# Altium project SmartOutletProject.PrjPcb
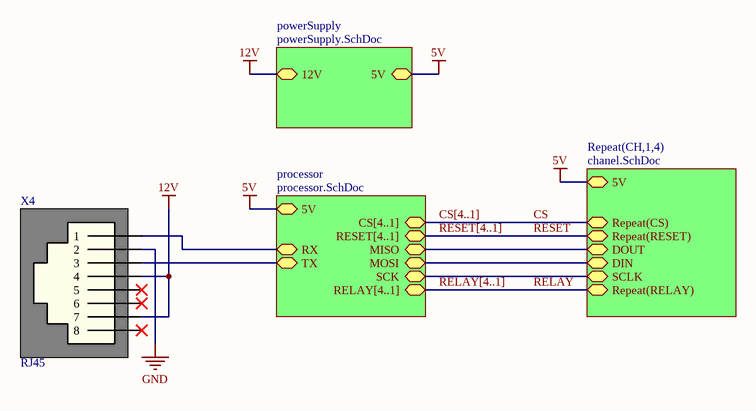
[diagram p0: main.SchDoc]
4 sheets, 214 parts. Net scope: hierarchical (ports join the sheet entries above them; power ports are global).
Board file: PCB.PcbDoc
Sheets:
  main.SchDoc
    CH1 = chanel.SchDoc
    CH2 = chanel.SchDoc
    CH3 = chanel.SchDoc
    CH4 = chanel.SchDoc
    processor = processor.SchDoc
    powerSupply = powerSupply.SchDoc

## Sheet main.SchDoc
size A

### Parts
X4  RJ45  [RJ45]

### Sub-sheets
powerSupply = powerSupply.SchDoc: 5V, 12V
processor = processor.SchDoc: MISO, RELAY[4..1], RESET[4..1], CS[4..1], MOSI, SCK, RX, TX, 5V
Repeat(CH,1,4) = chanel.SchDoc: Repeat(CS), Repeat(RESET), DOUT, DIN, SCLK, Repeat(RELAY), 5V

### Nets
5V: sheet Repeat(CH,1,4)/5V, sheet processor/5V, sheet powerSupply/5V
12V: X4.4 X4.7 ; sheet powerSupply/12V
GND: X4.2
CS: sheet Repeat(CH,1,4)/Repeat(CS)
MISO: sheet Repeat(CH,1,4)/DOUT, sheet processor/MISO
MOSI: sheet Repeat(CH,1,4)/DIN, sheet processor/MOSI
RELAY: sheet Repeat(CH,1,4)/Repeat(RELAY)
RESET: sheet Repeat(CH,1,4)/Repeat(RESET)
RX: X4.1 ; sheet processor/RX
SCK: sheet Repeat(CH,1,4)/SCLK, sheet processor/SCK
TX: X4.3 ; sheet processor/TX

Not connected (* = marked no-connect by the designer): X4 5* 6* 8*

### Buses and harness runs
bus CS[4..1] = sheet processor/CS[4..1]
bus RELAY[4..1] = sheet processor/RELAY[4..1]
bus RESET[4..1] = sheet processor/RESET[4..1]

### Library data of the parts
X4 = RJ45: Outlet YH-55-05 8P8C 5521; Link: https://www.rcscomponents.kiev.ua/product/rozetka-yh-55-05-8p8c-5521-l-kls12-133-8p8c-w-o-2-01_8324.html

## Sheet chanel.SchDoc
size A4
Used 4 times, as channels CH1, CH2, CH3, CH4. Parts and nets are listed once, with the designators drawn on the sheet.
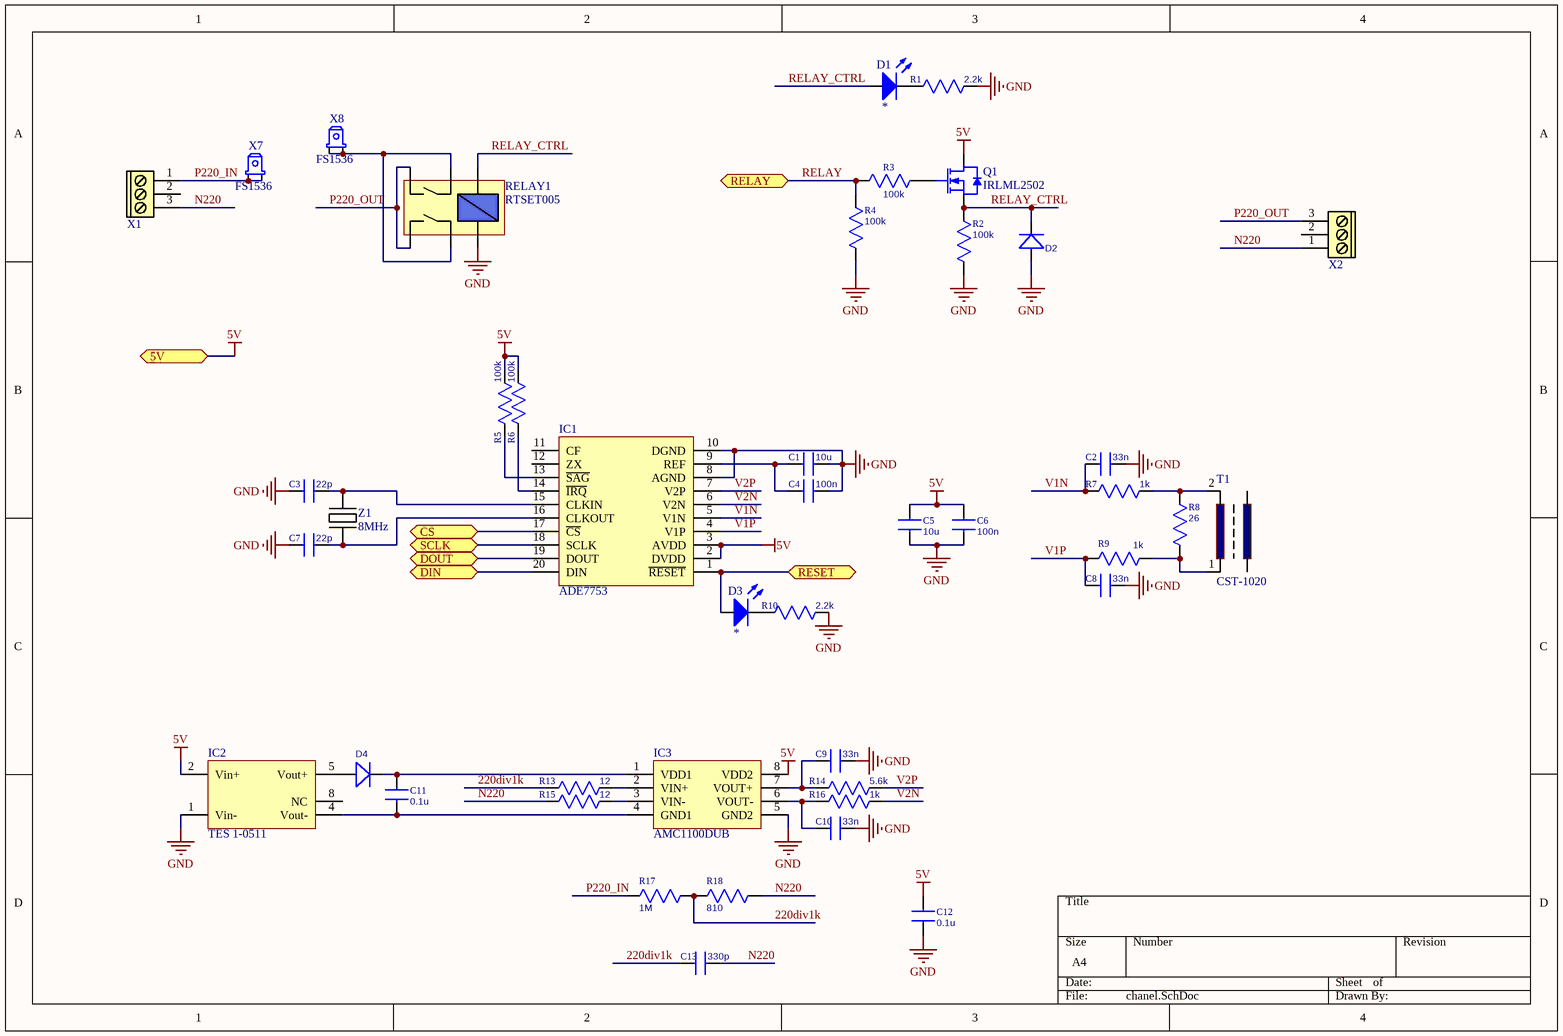
[diagram p1: chanel.SchDoc]

### Parts
C1  10u  [C_0805]
C2  33n  [C_0603]
C3  22p  [C_0603]
C4  100n  [C_0603]
C5  10u  [C_0805]
C6  100n  [C_0603]
C7  22p  [C_0603]
C8  33n  [C_0603]
C9  33n  [C_0603]
C10  33n  [C_0603]
C11  0.1u  [C_0603]
C12  0.1u  [C_0603]
C13  330p  [C_0603]
D1  *  [LED_5mm]
D2  D_DO-214AC  [DO-214AC]  (value not drawn)
D3  *  [LED_5mm]
D4  D_DO-214AC  [DO-214AC]  (value not drawn)
IC1  ADE7753  [SOP-20]
IC2  TES 1-0511  [TES 1-0511]
IC3  AMC1100DUB  [SOP254-8N]
Q1  IRLML2502  [SOT23]
R1  2.2k  [R_0603]
R2  100k  [R_0603]
R3  100k  [R_0603]
R4  100k  [R_0603]
R5  100k  [R_0603]
R6  100k  [R_0603]
R7  1k  [R_0603]
R8  26  [R_0805]
R9  1k  [R_0603]
R10  2.2k  [R_0603]
R13  12  [R_0603]
R14  5.6k  [R_0603]
R15  12  [R_0603]
R16  1k  [R_0603]
R17  1M  [R_0805]
R18  810  [R_0805]
RELAY1  RTSET005  [RTSET005]
T1  CST-1020  [CST-1020]
X1  DG-300-3  [DG-300-5MM-3]  (value not drawn)
X2  DG-300-3  [DG-300-5MM-3]  (value not drawn)
X7  FS1536  [FS1536]
X8  FS1536  [FS1536]
Z1  8MHz  [HC-49]

### Ports
5V, CS, DIN, DOUT, RELAY, RESET, SCLK

### Nets
5V: C5.2 C6.2 C12.2 IC1.2(DVDD) IC1.3(AVDD) IC2.2(Vin+) IC3.8(VDD2) Q1.3(D) R5.2 R6.2 ; port 5V
GND: C1.2 C2.2 C3.1 C4.2 C5.1 C6.1 C7.1 C8.2 C9.2 C10.2 C12.1 D2.1(A) IC1.8(AGND) IC1.10(DGND) IC2.1(Vin-) IC3.5(GND2) R1.2 R2.2 R4.2 R10.2 RELAY1.6
220div1k: C13.1 R13.1 R17.2 R18.1
CS: IC1.17(~{CS}) ; port CS
DIN: IC1.20(DIN) ; port DIN
DOUT: IC1.19(DOUT) ; port DOUT
N220: C13.2 R15.1 R18.2 X1.3 X2.1
P220_IN: R17.1 X1.1 X7.1
P220_OUT: RELAY1.1 RELAY1.2 X2.3
RELAY: R3.2 R4.1 ; port RELAY
RELAY_CTRL: D1.1(A) D2.2(K) Q1.2(S) R2.1 RELAY1.5
RESET: D3.1(A) IC1.1(~{RESET}) ; port RESET
SCLK: IC1.18(SCLK) ; port SCLK
V1N: C2.1 IC1.5(V1N) R7.1
V1P: C8.1 IC1.4(V1P) R9.1
V2N: IC1.6(V2N) R16.2
V2P: IC1.7(V2P) R14.2
NetC1_1: C1.1 C4.1 IC1.9(REF)
NetC3_2: C3.2 IC1.15(CLKIN) Z1.2
NetC7_2: C7.2 IC1.16(CLKOUT) Z1.1
NetC9_1: C9.1 IC3.7(VOUT+) R14.1
NetC10_1: C10.1 IC3.6(VOUT-) R16.1
NetC11_1: C11.1 IC2.4(Vout-) IC3.4(GND1)
NetC11_2: C11.2 D4.2(K) IC3.1(VDD1)
NetD1_2: D1.2(K) R1.1
NetD3_2: D3.2(K) R10.1
NetD4_1: D4.1(A) IC2.5(Vout+)
NetIC1_13: IC1.13(~{SAG}) R5.1
NetIC1_14: IC1.14(~{IRQ}) R6.1
NetIC3_2: IC3.2(VIN+) R13.2
NetIC3_3: IC3.3(VIN-) R15.2
NetQ1_1: Q1.1(G) R3.1
NetR7_2: R7.2 R8.1 T1.2
NetR8_2: R8.2 R9.2 T1.1
NetRELAY1_3: RELAY1.3 RELAY1.4 X8.1

Not connected (* = marked no-connect by the designer): IC1 11(CF) 12(ZX); IC2 8(NC); X1 2; X2 2

### Channels
CH1: designators end in _CH1; ports 5V=5V CS=CS1 DIN=MOSI DOUT=MISO RELAY=RELAY RESET=RESET1 SCLK=SCK
CH2: designators end in _CH2; ports 5V=5V CS=CS2 DIN=MOSI DOUT=MISO RELAY=RELAY RESET=RESET2 SCLK=SCK
CH3: designators end in _CH3; ports 5V=5V CS=CS3 DIN=MOSI DOUT=MISO RELAY=RELAY RESET=RESET3 SCLK=SCK
CH4: designators end in _CH4; ports 5V=5V CS=CS4 DIN=MOSI DOUT=MISO RELAY=RELAY RESET=RESET4 SCLK=SCK

### Library data of the parts
C1 C5 = C0805: Capacitor; Value: 10u
C2-C4 C6-C13 = C0603: Capacitor
  C2 C8-C10: Value: 33n
  C3 C7: Value: 22p
  C4 C6: Value: 100n
  C11 C12: Value: 0.1u
  C13: Value: 330p
D1 D3 = LED_5mm: Typical INFRARED GaAs LED; Value: *; Color: *
D2 D4 = D_DO-214AC: Diode
IC1 = ADE7753ARSZ: Data Acquisition ADC/DAC
IC2 = TES 1-0511: Isolated DC/DC Converter
IC3 = AMC1100DUB: Isolation Amplifier 4.25kV PEAK Iso Amp
Q1 = N-ch_SOT23: N-Channel Enhancement Mode MOSFET; Published: 17-Dec-2003; DatasheetVersion: May-99; PackageVersion: 1996; PackageReference: SOT23; Publisher: Altium Limited; PackageDescription: SOT-23; 3 Leads; Body 3.1 x 2.5 mm, inc. leads (LxW max), Alternate Lead Configuration; ComponentLink1Description: Manufacturer Link; ComponentLink1URL: http://www.zetex.com/; ComponentLink2Description: Datasheet; ComponentLink2URL: www.zetex.com/3.0/pdf/ZXM61N02F.pdf
R1-R7 R9 R10 R13-R16 = R0603: Resistor
  R1 R10: Value: 2.2k
  R2-R6: Value: 100k
  R7 R9 R16: Value: 1k
  R13 R15: Value: 12
  R14: Value: 5.6k
R8 R17 R18 = R0805: Resistor
  R8: Value: 26
  R17: Value: 1M
  R18: Value: 810
RELAY1 = 1-1415898-8: General Purpose Relay
T1 = CST-1020: Current Transformer
X7 X8 = FS1536: PCB Soldering tips
Z1 = XTAL: Quartz resonator

## Sheet processor.SchDoc
size A4
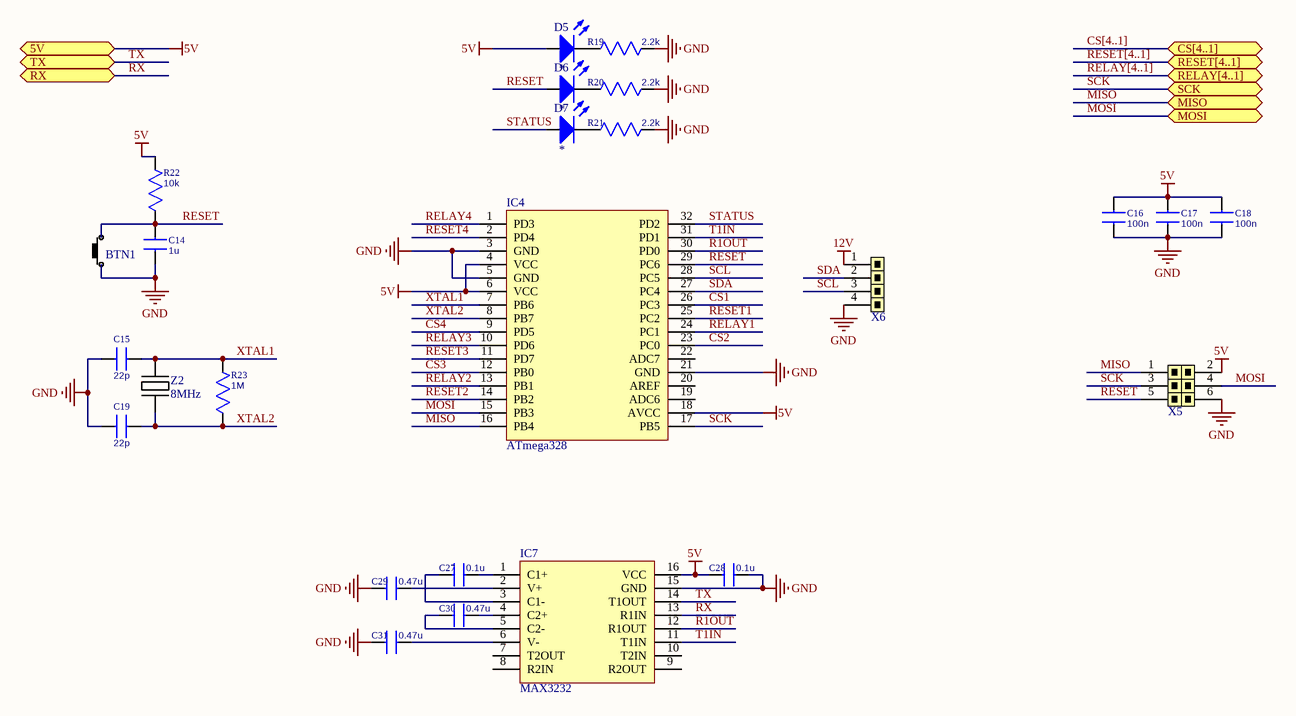
[diagram p2: processor.SchDoc]

### Parts
BTN1  Push Button  [PUSH BUTTON]  (value not drawn)
C14  1u  [C_0603]
C15  22p  [C_0603]
C16  100n  [C_0603]
C17  100n  [C_0603]
C18  100n  [C_0603]
C19  22p  [C_0603]
C27  0.1u  [C_0805]
C28  0.1u  [C_0805]
C29  0.47u  [C_0805]
C30  0.47u  [C_0805]
C31  0.47u  [C_0805]
D5  *  [LED_5mm]
D6  *  [LED_5mm]
D7  *  [LED_5mm]
IC4  ATmega328  [TQFP-32]
IC7  MAX3232  [SSOP-16]
R19  2.2k  [R_0603]
R20  2.2k  [R_0603]
R21  2.2k  [R_0603]
R22  10k  [R_0603]
R23  1M  [R_0603]
X5  PLD-6  [PLD-6]  (value not drawn)
X6  PLS-4  [PLS-4]  (value not drawn)
Z2  8MHz  [HC-49]

### Ports
5V, CS[4..1], MISO, MOSI, RELAY[4..1], RESET[4..1], RX, SCK, TX

### Nets
5V: C16.2 C17.2 C18.2 C28.1 D5.1(A) IC4.4(VCC) IC4.6(VCC) IC4.18(AVCC) IC7.16(VCC) R22.1 X5.2 ; port 5V
12V: X6.1
GND: BTN1.1 C14.1 C15.2 C16.1 C17.1 C18.1 C19.2 C28.2 C29.1 C31.1 IC4.3(GND) IC4.5(GND) IC4.21(GND) IC7.15(GND) R19.2 R20.2 R21.2 X5.6 X6.4
CS1: IC4.26(PC3)
CS2: IC4.23(PC0)
CS3: IC4.12(PB0)
CS4: IC4.9(PD5)
MISO: IC4.16(PB4) X5.1 ; port MISO
MOSI: IC4.15(PB3) X5.4 ; port MOSI
R1OUT: IC4.30(PD0) IC7.12(R1OUT)
RELAY1: IC4.24(PC1)  [project net RELAY]
RELAY2: IC4.13(PB1)  [project net RELAY]
RELAY3: IC4.10(PD6)  [project net RELAY]
RELAY4: IC4.1(PD3)  [project net RELAY]
RESET: BTN1.2 C14.2 D6.1(A) IC4.29(PC6) R22.2 X5.5
RESET1: IC4.25(PC2)
RESET2: IC4.14(PB2)
RESET3: IC4.11(PD7)
RESET4: IC4.2(PD4)
RX: IC7.13(R1IN) ; port RX
SCK: IC4.17(PB5) X5.3 ; port SCK
SCL: IC4.28(PC5) X6.3
SDA: IC4.27(PC4) X6.2
STATUS: D7.1(A) IC4.32(PD2)
T1IN: IC4.31(PD1) IC7.11(T1IN)
TX: IC7.14(T1OUT) ; port TX
XTAL1: C15.1 IC4.7(PB6) R23.1 Z2.2
XTAL2: C19.1 IC4.8(PB7) R23.2 Z2.1
NetC27_1: C27.1 IC7.3(C1-)
NetC27_2: C27.2 IC7.1(C1+)
NetC29_2: C29.2 IC7.2(V+)
NetC30_1: C30.1 IC7.5(C2-)
NetC30_2: C30.2 IC7.4(C2+)
NetC31_2: C31.2 IC7.6(V-)
NetD5_2: D5.2(K) R19.1
NetD6_2: D6.2(K) R20.1
NetD7_2: D7.2(K) R21.1

Not connected (* = marked no-connect by the designer): IC4 19(ADC6) 20(AREF) 22(ADC7); IC7 7(T2OUT) 8(R2IN) 9(R2OUT) 10(T2IN)

### Buses and harness runs
bus CS[4..1] = port CS[4..1]
bus RELAY[4..1] = port RELAY[4..1]
bus RESET[4..1] = port RESET[4..1]

### Library data of the parts
C14-C19 = C0603: Capacitor
  C14: Value: 1u
  C15 C19: Value: 22p
  C16-C18: Value: 100n
C27-C31 = C0805: Capacitor
  C27 C28: Value: 0.1u
  C29-C31: Value: 0.47u
D5-D7 = LED_5mm: Typical INFRARED GaAs LED; Value: *; Color: *
IC4 = ATmega328: High Performance, Low Power Atmel AVR 8-Bit Microcontroller
IC7 = MAX3232: RS-232 Line Driver/Receiver With ±15-kV ESD Protection
R19-R23 = R0603: Resistor
  R19-R21: Value: 2.2k
  R22: Value: 10k
  R23: Value: 1M
Z2 = XTAL: Quartz resonator

## Sheet powerSupply.SchDoc
size A
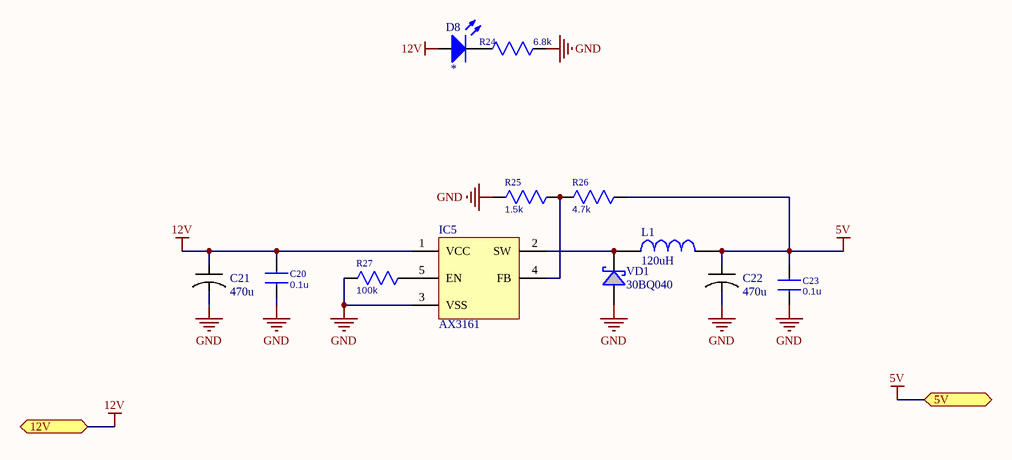
[diagram p3: powerSupply.SchDoc]

### Parts
C20  0.1u  [C_0603]
C21  470u  [ELV471M25RF]
C22  470u  [ELV471M25RF]
C23  0.1u  [C_0603]
D8  *  [LED_5mm]
IC5  AX3161  [TO263-5L]
L1  120uH  [L-12.3x12.3]
R24  6.8k  [R_0603]
R25  1.5k  [R_0603]
R26  4.7k  [R_0603]
R27  100k  [R_0603]
VD1  30BQ040  [DO-214AB (SMC)]

### Ports
5V, 12V

### Nets
5V: C22.1 C23.2 L1.2 R26.1 ; port 5V
12V: C20.2 C21.1 D8.1(A) IC5.1(VCC) ; port 12V
GND: C20.1 C21.2 C22.2 C23.1 IC5.3(VSS) R24.2 R25.2 R27.2 VD1.A
NetD8_2: D8.2(K) R24.1
NetIC5_2: IC5.2(SW) L1.1 VD1.C
NetIC5_4: IC5.4(FB) R25.1 R26.2
NetIC5_5: IC5.5(EN) R27.1

### Library data of the parts
C20 C23 = C0603: Capacitor; Value: 0.1u
C21 C22 = Electrolit: Electrolit capasitor; Value: 470u
D8 = LED_5mm: Typical INFRARED GaAs LED; Value: *; Color: *
IC5 = AX3161: 52KHz, 2A PWM Buck DC/DC Converter; Link: https://voron.ua/catalog/031858
L1 = L: Inductor; Value: 120uH
R24-R27 = R0603: Resistor
  R24: Value: 6.8k
  R25: Value: 1.5k
  R26: Value: 4.7k
  R27: Value: 100k
VD1 = 30BQ040: High Performance Schottky Rectifier, 3.0 A; Link: https://voron.ua/catalog/schottky-diode-30bq040-irf

## Nets that join several sheets
5V: CH1 (10 pins), CH2 (10 pins), CH3 (10 pins), CH4 (10 pins), processor (11 pins), powerSupply (C22.1 C23.2 L1.2 R26.1)
12V: main (X4.4 X4.7), processor (X6.1), powerSupply (C20.2 C21.1 D8.1 IC5.1)
GND: main (X4.2), CH1 (21 pins), CH2 (21 pins), CH3 (21 pins), CH4 (21 pins), processor (19 pins), powerSupply (9 pins)
CS1: CH1 (IC1_CH1.17), processor (IC4.26)
CS2: CH2 (IC1_CH2.17), processor (IC4.23)
CS3: CH3 (IC1_CH3.17), processor (IC4.12)
CS4: CH4 (IC1_CH4.17), processor (IC4.9)
MISO: CH1 (IC1_CH1.19), CH2 (IC1_CH2.19), CH3 (IC1_CH3.19), CH4 (IC1_CH4.19), processor (IC4.16 X5.1)
MOSI: CH1 (IC1_CH1.20), CH2 (IC1_CH2.20), CH3 (IC1_CH3.20), CH4 (IC1_CH4.20), processor (IC4.15 X5.4)
RELAY: CH1 (R3_CH1.2 R4_CH1.1), processor (IC4.24)
RELAY: CH2 (R3_CH2.2 R4_CH2.1), processor (IC4.13)
RELAY: CH3 (R3_CH3.2 R4_CH3.1), processor (IC4.10)
RELAY: CH4 (R3_CH4.2 R4_CH4.1), processor (IC4.1)
RESET1: CH1 (D3_CH1.1 IC1_CH1.1), processor (IC4.25)
RESET2: CH2 (D3_CH2.1 IC1_CH2.1), processor (IC4.14)
RESET3: CH3 (D3_CH3.1 IC1_CH3.1), processor (IC4.11)
RESET4: CH4 (D3_CH4.1 IC1_CH4.1), processor (IC4.2)
RX: main (X4.1), processor (IC7.13)
SCK: CH1 (IC1_CH1.18), CH2 (IC1_CH2.18), CH3 (IC1_CH3.18), CH4 (IC1_CH4.18), processor (IC4.17 X5.3)
TX: main (X4.3), processor (IC7.14)